# Altium schematic sheet 800U-R3N3_LED_V1.1.SchDoc
size Letter
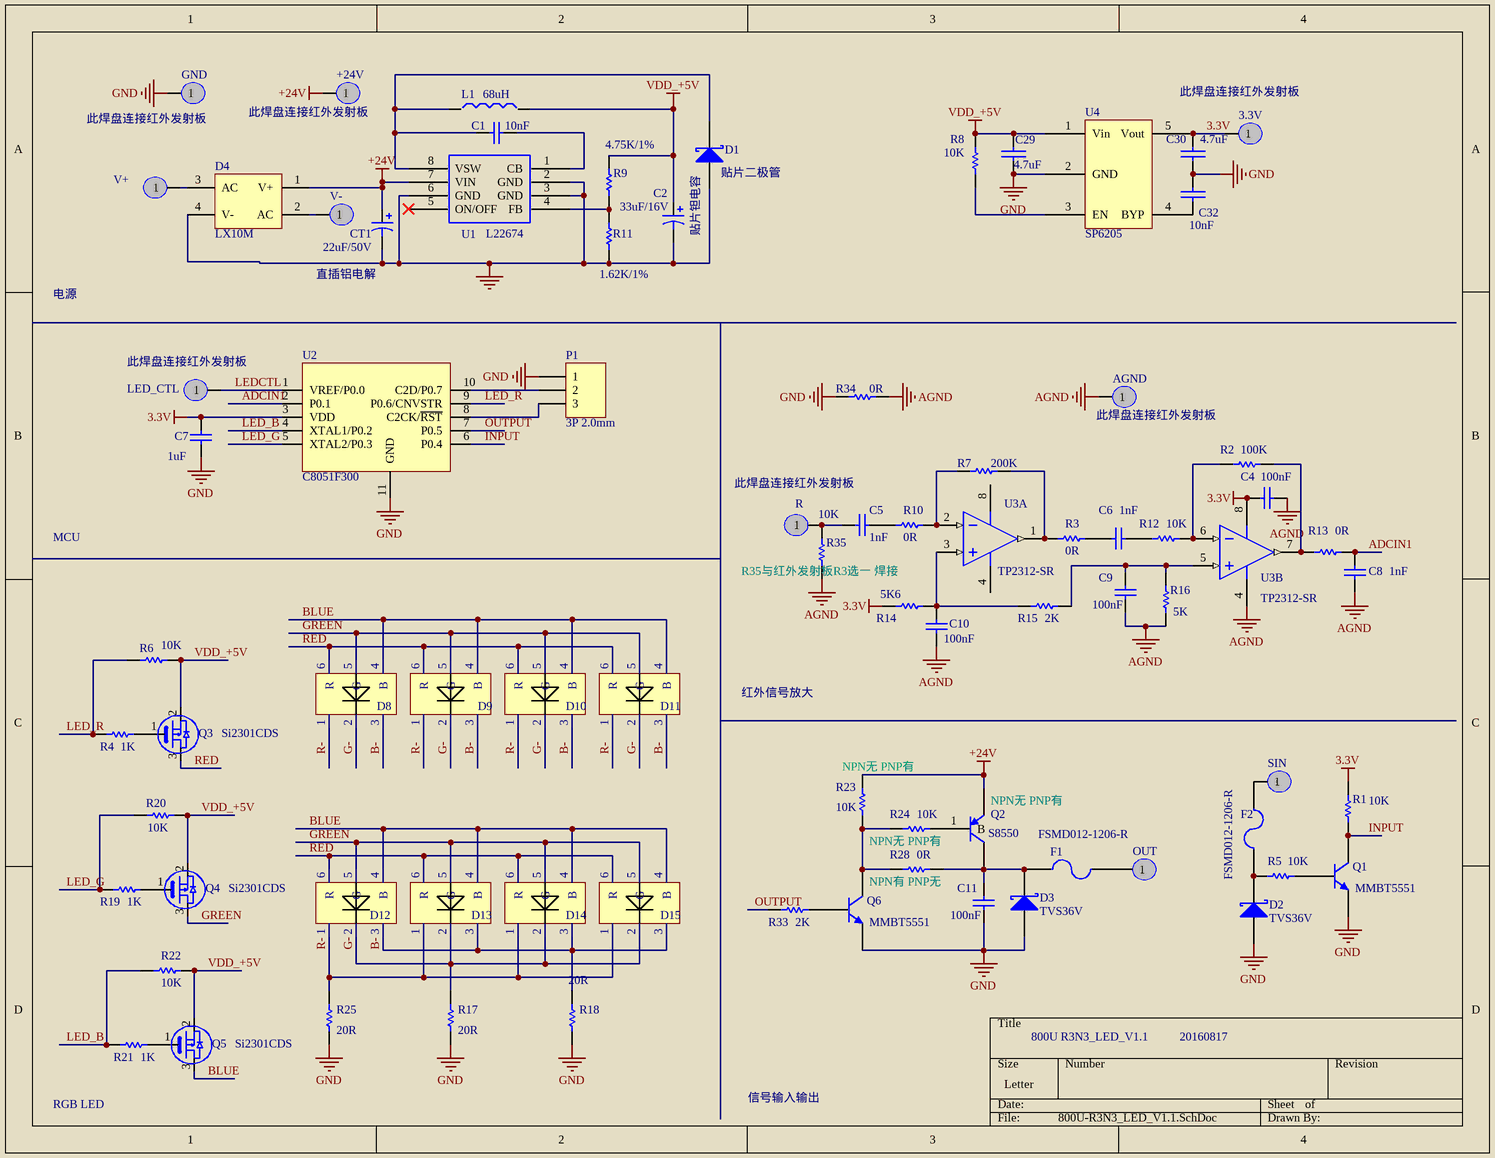
[diagram p0: 800U-R3N3_LED_V1.1.SchDoc]

## Parts
3.3V  (no value)  [HOLE_SMD]
+24V  (no value)  [HOLE_SMD]
AGND  (no value)  [HOLE_SMD]
C1  10nF  [C0603]
C2  33uF/16V  Kind: 贴片钽电容  [CT3528]
C4  100nF  [C0603]
C5  1nF  [C0603]
C6  1nF  [C0603]
C7  1uF  [C0603]
C8  1nF  [C0603]
C9  100nF  [C0603]
C10  100nF  [C0603]
C11  100nF  [C0603]
C29  4.7uF  [C0603]
C30  4.7uF  [C0603]
C32  10nF  [C0603]
CT1  22uF/50V  Kind: 直插铝电解  [RB0.1]
D1  Kind: 贴片二极管  [SMB]  (hidden comment: SS14)
D2  TVS36V  [HSMA]
D3  TVS36V  [HSMA]
D4  LX10M  [桥堆 3.8*3.5]
D8  5050RGB  [5050RGB]  (value not drawn)
D9  5050RGB  [5050RGB]  (value not drawn)
D10  5050RGB  [5050RGB]  (value not drawn)
D11  5050RGB  [5050RGB]  (value not drawn)
D12  5050RGB  [5050RGB]  (value not drawn)
D13  5050RGB  [5050RGB]  (value not drawn)
D14  5050RGB  [5050RGB]  (value not drawn)
D15  5050RGB  [5050RGB]  (value not drawn)
F1  FSMD012-1206-R  [1206]
F2  FSMD012-1206-R  [1206]
GND  (no value)  [HOLE_SMD]
L1  68uH  [L-6X6]
LED_CTL  (no value)  [HOLE_SMD]
OUT  (no value)  [HOLE_SMD]
P1  3P 2.0mm  [SIP3]
Q1  MMBT5551  [SOT-23]
Q2  S8550  [SOT-23]
Q3  Si2301CDS  [SOT-23]
Q4  Si2301CDS  [SOT-23]
Q5  Si2301CDS  [SOT-23]
Q6  MMBT5551  [SOT-23]
R  (no value)  [HOLE_SMD]
R1  10K  [R0603]
R2  100K  [R0603]
R3  0R  [R0603]
R4  1K  [R0603]
R5  10K  [R0603]
R6  10K  [R0603]
R7  200K  [R0603]
R8  10K  [R0603]
R9  4.75K/1%  [R0603]
R10  0R  [R0603]
R11  1.62K/1%  [R0603]
R12  10K  [R0603]
R13  0R  [R0603]
R14  5K6  [R0603]
R15  2K  [R0603]
R16  5K  [R0603]
R17  20R  [2010]
R18  20R  [2010]
R19  1K  [R0603]
R20  10K  [R0603]
R21  1K  [R0603]
R22  10K  [R0603]
R23  10K  [R0603]
R24  10K  [R0603]
R25  20R  [2010]
R28  0R  [R0603]
R33  2K  [R0603]
R34  0R  [R0603]
R35  10K  [R0603]
SIN  (no value)  [HOLE_SMD]
U1  L22674  [SO-1.27-9/4.0]
U2  C8051F300  [QFN-11]
U3  TP2312-SR  [SO-8]  (parts A,B of 2)
U4  SP6205  [SOT-23-5]
V+  (no value)  [HOLE_SMD]
V-  (no value)  [HOLE_SMD]

## Nets
3.3V: 3.3V.1 C4.1 C7.1 C30.1 R1.2 R14.1 U2.3(VDD) U3.8(VCC) U4.5(Vout)
+24V: +24V.1 CT1.1 D4.1(V+) Q2.2(E) R23.2 U1.7(VIN)
AGND: AGND.1 C4.2 C8.1 C9.2 C10.2 R16.1 R34.2 R35.2 U3.4(VEE)
GND: C2.2 C7.2 C11.2 C29.2 C30.2 C32.2 CT1.2 D1.1(A) D2.1(A) D3.1(A) D4.4(V-) GND.1 P1.1 Q1.2(E) Q6.2(E) R11.1 R17.1 R18.1 R25.1 R34.1 U1.2(GND) U1.3(GND) U1.6(GND) U2.11(GND) U4.2(GND)
VDD_+5V: C2.1 C29.1 L1.2 Q3.2(S) Q4.2(S) Q5.2(S) R6.1 R8.1 R9.2 R20.1 R22.1 U4.1(Vin)
ADCIN1: C8.2 R13.2 U2.2(P0.1)
B-: D8.3 D9.3 D10.3 D11.3 D12.3 D13.3 D14.3 D15.3 R18.2
BLUE: D8.4(B) D9.4(B) D10.4(B) D11.4(B) D12.4(B) D13.4(B) D14.4(B) D15.4(B) Q5.3(D)
G-: D8.2 D9.2 D10.2 D11.2 D12.2 D13.2 D14.2 D15.2 R17.2
GREEN: D8.5(G) D9.5(G) D10.5(G) D11.5(G) D12.5(G) D13.5(G) D14.5(G) D15.5(G) Q4.3(D)
INPUT: Q1.3(C) R1.1 U2.6(P0.4)
LED_B: R21.2 R22.2 U2.4(XTAL1/P0.2)
LED_G: R19.2 R20.2 U2.5(XTAL2/P0.3)
LED_R: R4.2 R6.2 U2.9(P0.6/CNVSTR)
LEDCTL: LED_CTL.1 U2.1(VREF/P0.0)
OUTPUT: R33.2 U2.7(P0.5)
R-: D8.1 D9.1 D10.1 D11.1 D12.1 D13.1 D14.1 D15.1 R25.2
RED: D8.6(R) D9.6(R) D10.6(R) D11.6(R) D12.6(R) D13.6(R) D14.6(R) D15.6(R) Q3.3(D)
NetC1_1: C1.1 U1.1(CB)
NetC1_2: C1.2 D1.2(K) L1.1 U1.8(VSW)
NetC5_1: C5.1 R.1 R35.1
NetC5_2: C5.2 R10.1
NetC6_1: C6.1 R3.2
NetC6_2: C6.2 R12.1
NetC9_1: C9.1 R15.2 R16.2 U3.5(IN+)
NetC10_1: C10.1 R14.2 R15.1 U3.3(IN+)
NetC11_1: C11.1 D3.2(K) F1.2 Q2.3(C) R28.2
NetC32_1: C32.1 U4.4(BYP)
NetD2_2: D2.2(K) F2.1 R5.1
NetD4_2: D4.2(AC) V-.1
NetD4_3: D4.3(AC) V+.1
NetF1_1: F1.1 OUT.1
NetF2_2: F2.2 SIN.1
NetP1_2: P1.2 U2.10(C2D/P0.7)
NetP1_3: P1.3 U2.8(C2CK/~{RST})
NetQ1_1: Q1.1(B) R5.2
NetQ2_1: Q2.1(B) R24.2
NetQ3_1: Q3.1(G) R4.1
NetQ4_1: Q4.1(G) R19.1
NetQ5_1: Q5.1(G) R21.1
NetQ6_1: Q6.1(B) R33.1
NetQ6_3: Q6.3(C) R23.1 R24.1 R28.1
NetR2_1: R2.1 R12.2 U3.6(IN-)
NetR2_2: R2.2 R13.1 U3.7(OUT)
NetR3_1: R3.1 R7.2 U3.1(OUT)
NetR7_1: R7.1 R10.2 U3.2(IN-)
NetR8_2: R8.2 U4.3(EN)
NetR9_1: R9.1 R11.2 U1.4(FB)

Not connected (* = marked no-connect by the designer): U1 5(ON/OFF)*

## Notes on the sheet
- 电源
- MCU
- 红外信号放大
- 800U R3N3_LED_V1.1
- 20160817
- RGB LED
- 信号输入输出
- (in symbol Res Semi) NPN无 PNP有; NPN有 PNP无; R35与红外发射板R3选一 焊接
- (in symbol S8550) NPN无 PNP有
- (in symbol 焊盘) 此焊盘连接红外发射板

## Library data of the parts
3.3V +24V AGND GND LED_CTL OUT R SIN V+ V- = 焊盘
C1 C4-C6 C8-C10 = Cap: Capacitor; Kind: 贴片电容; Published: 8-Jun-2000; LatestRevisionDate: 17-Jul-2002; LatestRevisionNote: Re-released for DXP Platform.; PackageReference: RAD-0.3; Publisher: Altium Limited
  C1: PackageDescription: Radial Cap, Thru-Hole; 2 Leads; 0.3 in Pin Spacing
C2 CT1 = Cap Pol1: Polarized Capacitor (Radial); Published: 8-Jun-2000; LatestRevisionDate: 17-Jul-2002; LatestRevisionNote: Re-released for DXP Platform.; PackageReference: RB7.6-15
C7 C11 = Cap: 贴片电容; Published: 8-Jun-2000; LatestRevisionDate: 17-Jul-2002; LatestRevisionNote: Re-released for DXP Platform.; PackageReference: RAD-0.3; Publisher: Altium Limited; Kind: 贴片电容
C29 C30 C32 = CAP: Capacitor; Kind: 贴片电容
D1 = SMBJ6.0CA
D2 D3 = D Schottky: 贴片TVS; Kind: 贴片二极管; Published: 8-Jun-2000; LatestRevisionDate: 17-Jul-2002; LatestRevisionNote: Re-released for DXP Platform.; PackageReference: SMB; Publisher: Altium Limited; Code_JEDEC: DO-214-AA
D4 = Bridge2: 贴片桥堆; Kind: 贴片桥堆
D8-D15 = 5050RGB: RBG发光管; Kind: 贴片LED
F1 = Fuse 2: Fuse; Kind: 贴片保险丝; Published: 8-Jun-2000; LatestRevisionDate: 17-Jul-2002; LatestRevisionNote: Re-released for DXP Platform.; PackageReference: PIN-W2/E2.8
F2 = Fuse 2: Fuse; kind: 贴片保险丝; Published: 8-Jun-2000; LatestRevisionDate: 17-Jul-2002; LatestRevisionNote: Re-released for DXP Platform.; PackageReference: PIN-W2/E2.8
L1 = 电感: Kind: 贴片电感
P1 = MHDR1X3: 插座; Kind: 下载接口; LatestRevisionDate: 17-Jul-2002; LatestRevisionNote: Re-released for DXP Platform.; Publisher: Altium Limited
Q1 = NPN: 贴片NPN三极管; Kind: 贴片三极管
Q2 = S8550: 贴片PNP三极管; Kind: 贴片三极管
Q3-Q5 = P-MOSFET: 贴片MOS管; Kind: MOS管
Q6 = NPN: NPN三极管; Kind: 贴片三极管
R1 R4-R6 R17-R25 R28 R33 = Res Semi: 贴片电阻; Kind: 贴片电阻
R2 R3 R7 R9-R16 R34 R35 = Res Semi: Semiconductor Resistor; Kind: 贴片电阻
  R9 R11: Published: 8-Jun-2000; LatestRevisionDate: 17-Jul-2002; LatestRevisionNote: Re-released for DXP Platform.; PackageReference: AXIAL-0.5; Publisher: Altium Limited
R8 = Res1: Resistor; Kind: 贴片电阻; Published: 8-Jun-2000; LatestRevisionDate: 17-Jul-2002; LatestRevisionNote: Re-released for DXP Platform.; PackageReference: AXIAL-0.3; Publisher: Altium Limited
U1 = 2674: Kind: 贴片芯片; PCB DECAL: SO-1.27-9/4.0
U2 = PIC16C505: 贴片芯片; Kind: 贴片芯片
U3 = LM833D: Dual Low Noise, Audio Amplifier; Kind: 贴片芯片
U4 = SP6203/SP6205: Kind: 贴片芯片